# EAGLE schematic zikzak3-modules-gpu (EAGLE 6.4)
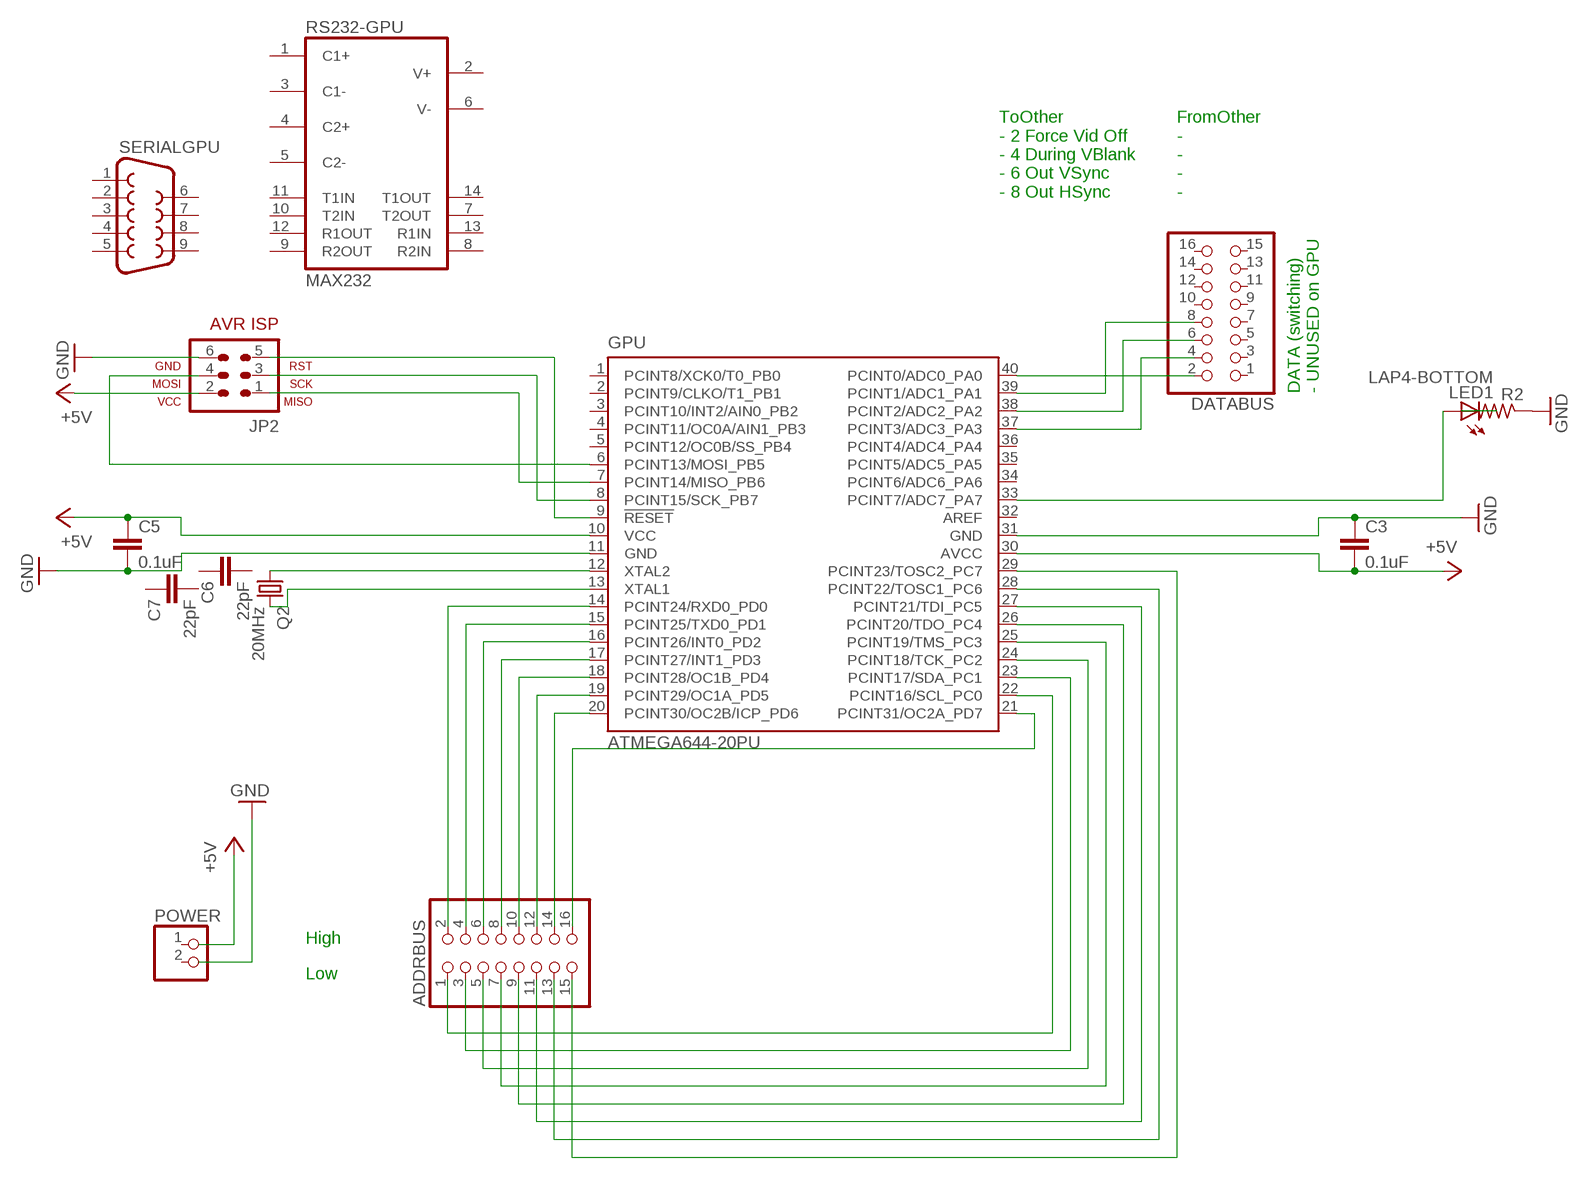
[diagram p0: schematic, sheet 1]

## Parts
ADDRBUS  PINHD-2X8/90  [2X08/90]
C3  0.1uF  C2,5-3  [C2.5-3]
C5  0.1uF  C2,5-3  [C2.5-3]
C6  22pF  C2,5-3  [C2.5-3]
C7  22pF  C2,5-3  [C2.5-3]
DATABUS  PINHD-2X8/90  [2X08/90]
GPU  ATMEGA644-20PU  [DIL40]
JP2  AVR-ISP-6VERT  [AVR-ISP-6]
LED1  LAP4-BOTTOM  [P47F-BOTTOM]
POWER  PINHD-1X2  [1X02]
Q2  20MHz  CRYSTALTC38H  [TC38H]
R2  R-US_0204/2V  [0204V]
RS232-GPU  MAX232  [DIL16]
SERIALGPU  F09H  [F09H]

## Nets
+5V: C3.2 C5.1 GPU.10(VCC) GPU.30(AVCC) JP2.2
GND: C3.1 C5.2 GPU.11(GND) GPU.31(GND) JP2.6 R2.1
N$1: ADDRBUS.16 GPU.21(PCINT31/OC2A_PD7)
N$2: ADDRBUS.14 GPU.20(PCINT30/OC2B/ICP_PD6)
N$3: ADDRBUS.12 GPU.19(PCINT29/OC1A_PD5)
N$4: ADDRBUS.2 GPU.14(PCINT24/RXD0_PD0)
N$5: ADDRBUS.4 GPU.15(PCINT25/TXD0_PD1)
N$6: ADDRBUS.6 GPU.16(PCINT26/INT0_PD2)
N$7: ADDRBUS.8 GPU.17(PCINT27/INT1_PD3)
N$8: ADDRBUS.10 GPU.18(PCINT28/OC1B_PD4)
N$9: GPU.12(XTAL2) Q2.1
N$10: GPU.13(XTAL1) Q2.2
N$11: ADDRBUS.1 GPU.22(PCINT16/SCL_PC0)
N$12: ADDRBUS.3 GPU.23(PCINT17/SDA_PC1)
N$13: ADDRBUS.5 GPU.24(PCINT18/TCK_PC2)
N$14: ADDRBUS.7 GPU.25(PCINT19/TMS_PC3)
N$15: ADDRBUS.9 GPU.26(PCINT20/TDO_PC4)
N$16: ADDRBUS.11 GPU.27(PCINT21/TDI_PC5)
N$17: ADDRBUS.13 GPU.28(PCINT22/TOSC1_PC6)
N$18: ADDRBUS.15 GPU.29(PCINT23/TOSC2_PC7)
N$19: LED1.C R2.2
N$20: GPU.33(PCINT7/ADC7_PA7) LED1.A
N$21: DATABUS.2 GPU.40(PCINT0/ADC0_PA0)
N$22: DATABUS.4 GPU.37(PCINT3/ADC3_PA3)
N$23: DATABUS.6 GPU.38(PCINT2/ADC2_PA2)
N$24: DATABUS.8 GPU.39(PCINT1/ADC1_PA1)
N$78: GPU.6(PCINT13/MOSI_PB5) JP2.4
N$79: GPU.7(PCINT14/MISO_PB6) JP2.1
N$80: GPU.8(PCINT15/SCK_PB7) JP2.3
N$81: GPU.9(!RESET) JP2.5
Unconnected: C6.1 C6.2 C7.1 C7.2 DATABUS.1 DATABUS.3 DATABUS.5 DATABUS.7 DATABUS.9 DATABUS.10 DATABUS.11 DATABUS.12 DATABUS.13 DATABUS.14 DATABUS.15 DATABUS.16 GPU.1(PCINT8/XCK0/T0_PB0) GPU.2(PCINT9/CLKO/T1_PB1) GPU.3(PCINT10/INT2/AIN0_PB2) GPU.4(PCINT11/OC0A/AIN1_PB3) GPU.5(PCINT12/OC0B/SS_PB4) GPU.32(AREF) GPU.34(PCINT6/ADC6_PA6) GPU.35(PCINT5/ADC5_PA5) GPU.36(PCINT4/ADC4_PA4) POWER.1 POWER.2 RS232-GPU.1(C1+) RS232-GPU.2(V+) RS232-GPU.3(C1-) RS232-GPU.4(C2+) RS232-GPU.5(C2-) RS232-GPU.6(V-) RS232-GPU.7(T2OUT) RS232-GPU.8(R2IN) RS232-GPU.9(R2OUT) RS232-GPU.10(T2IN) RS232-GPU.11(T1IN) RS232-GPU.12(R1OUT) RS232-GPU.13(R1IN) RS232-GPU.14(T1OUT) SERIALGPU.1 SERIALGPU.2 SERIALGPU.3 SERIALGPU.4 SERIALGPU.5 SERIALGPU.6 SERIALGPU.7 SERIALGPU.8 SERIALGPU.9

## Notes on the sheet
- ToOther
  - 2 Force Vid Off
  - 4 During VBlank
  - 6 Out VSync
  - 8 Out HSync
- FromOther
  -
  -
  -
  -
- DATA (switching)
  - UNUSED on GPU
- High
- Low

## Power pins joined to a net without a drawn wire
GND: RS232-GPU.15(GND)
VCC: RS232-GPU.16(VCC)

## Library data of the parts
ADDRBUS DATABUS = pinhead:PINHD-2X8: PIN HEADER
C3 C5-C7 = capacitor-wima:C: CAPACITOR naming: grid - package width
GPU = atmel:ATMEGA644-*PU: 8-bit Microcontroller with 64K Bytes In-System Programmable Flash Auto generated by make-symbol-device-package-bsdl.ulp Rev. 34 Source: http://www.atmel.com/dyn/resources/prod_documents/doc2593.pdf; MPN: ATMEGA644-20PU; OC_FARNELL: 1288340; OC_NEWARK: 23M5060
JP2 = avr-7:AVR-ISP-6: AVR ISP-6 Serial Programming Header
LED1 = led:*P4: PointLED® Enhanced Thinfilm LED TOP & BOTTOM mount LS P47F, LR P47F, LA P47F, LY P47F, LT P4SG, LB P4SG, LW P4SG Source: http://catalog.osram-os.com .. LA_LR_LS_LY_P47F_Pb_free.pdf
POWER = pinhead:PINHD-1X2: PIN HEADER
Q2 = crystal:CRYSTAL: CRYSTAL; OC_FARNELL: unknown; OC_NEWARK: unknown
R2 = rcl:R-US_: RESISTOR, American symbol
RS232-GPU = maxim:MAX232: RS232 TRANSEIVER; MF: MAXIM; MPN: MAX232ACPE+; OC_FARNELL: 9723773; OC_NEWARK: 68K4544
SERIALGPU = con-subd:F09: SUB-D; OC_FARNELL: unknown; OC_NEWARK: unknown